# EAGLE design wtemp-receiver (EAGLE 5.11)
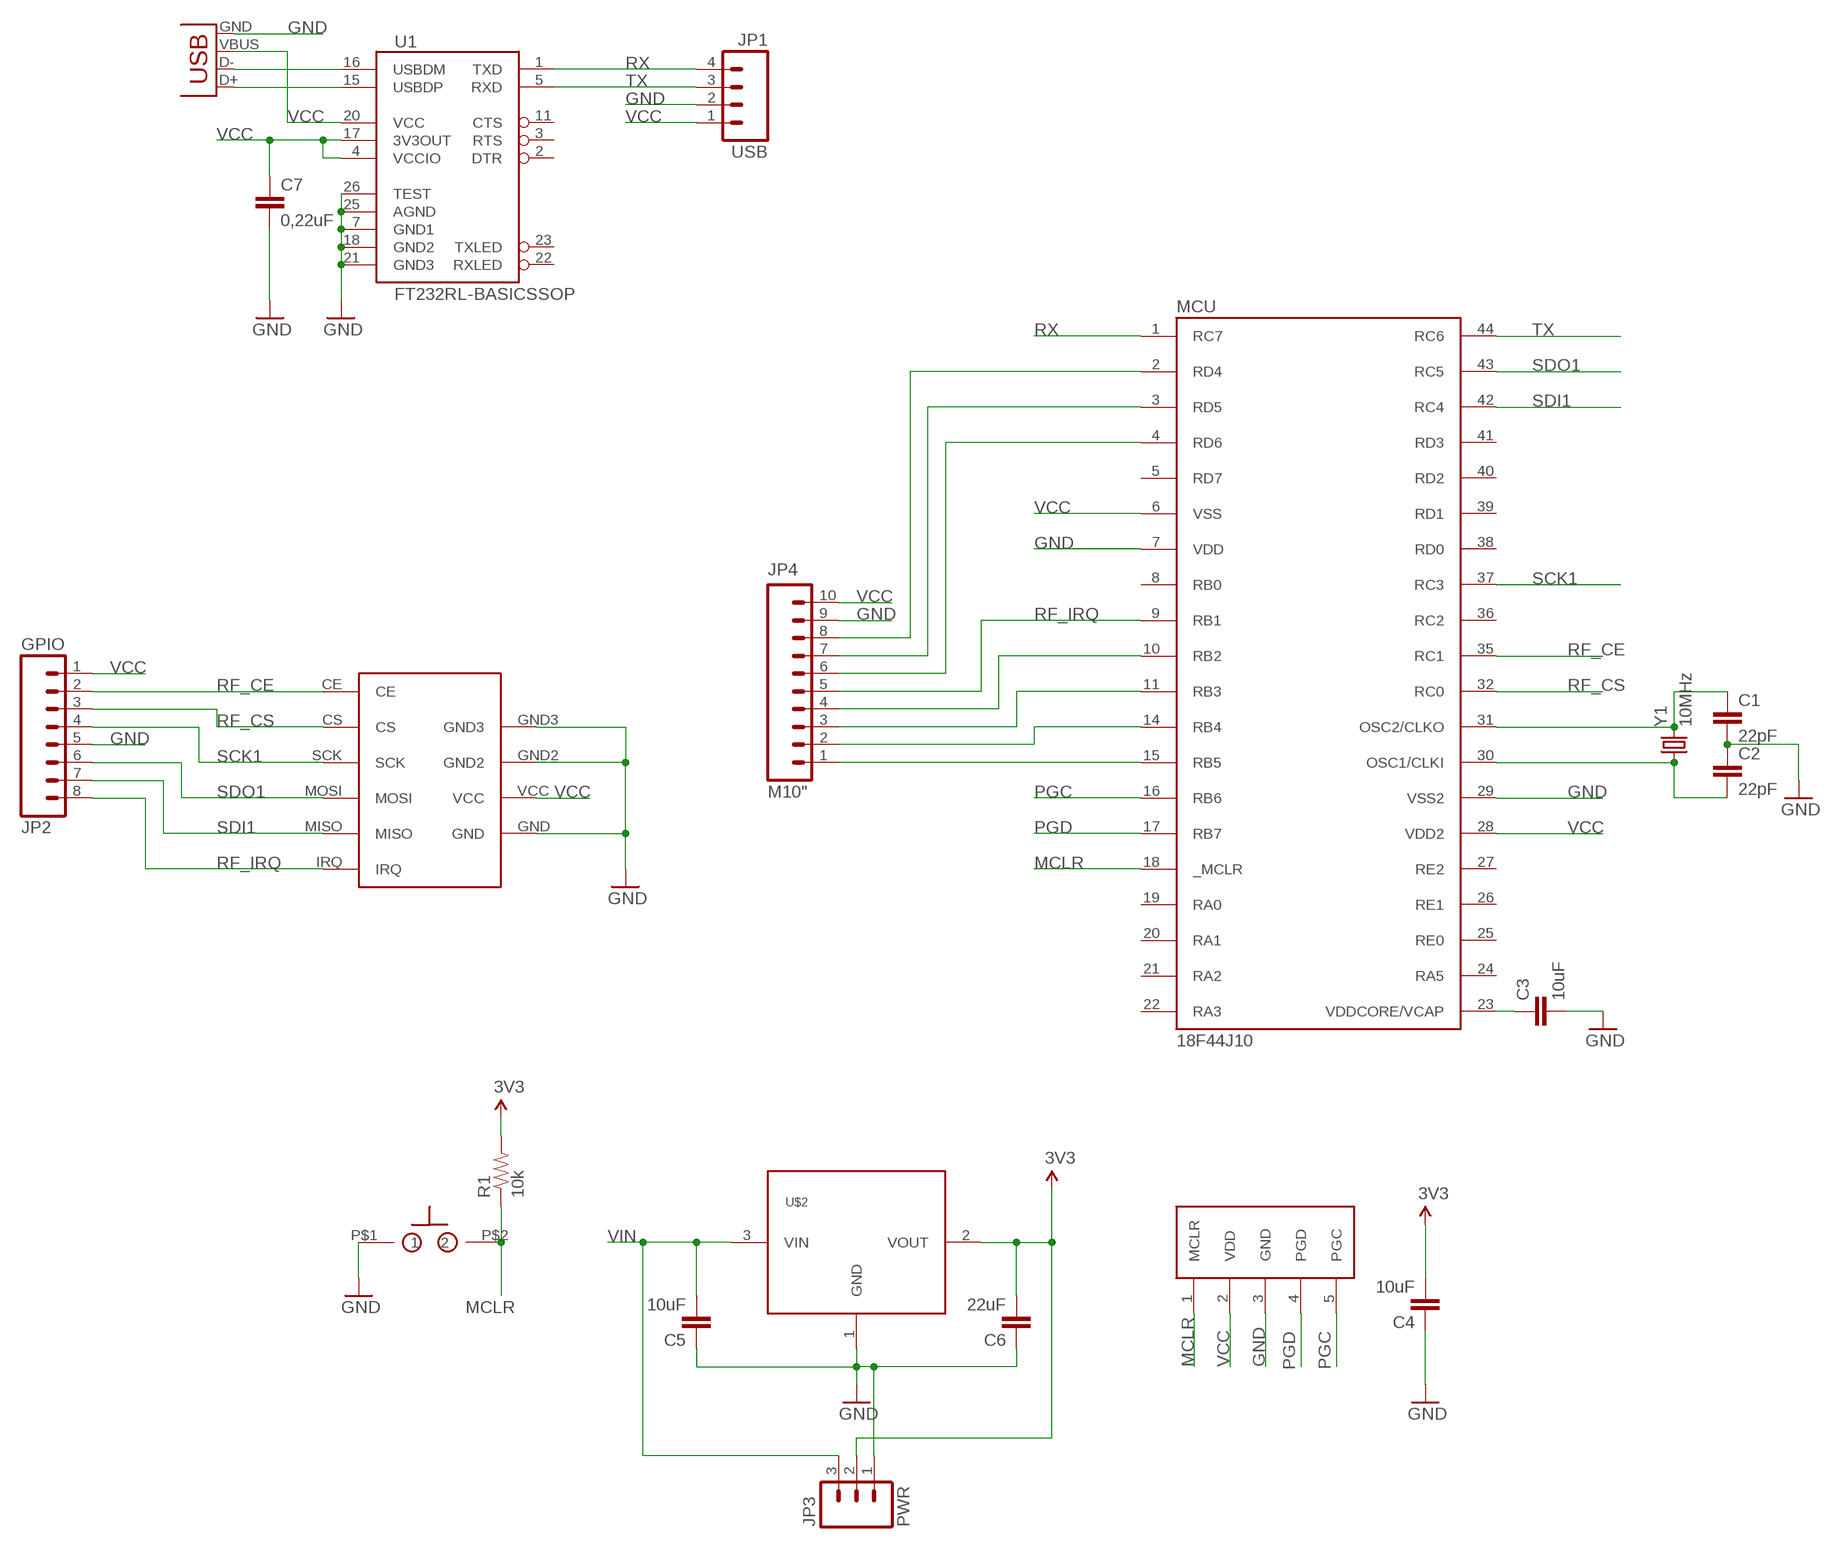
[diagram p0: schematic, sheet 1]

## Parts
C1  22pF  CAP0603-CAP  [0603-CAP]
C2  22pF  CAP0603-CAP  [0603-CAP]
C3  10uF  CAP0805  [0805]
C4  10uF  CAP0805  [0805]
C5  10uF  CAP0805  [0805]
C6  22uF  CAP0805  [0805]
C7  0,22uF  CAP0603-CAP  [0603-CAP]
JP1  USB  M041X04_NO_SILK  [1X04_NO_SILK]
JP2  GPIO  M081X08  [1X08]
JP3  PWR  M031X03_NO_SILK  [1X03_NO_SILK]
JP4  M10"  [1X10]
MCU  18F44J10  [TQFP44]
R1  10k  RESISTOR0603-RES  [0603-RES]
U1  FT232RL-BASICSSOP  [SSOP28DB]
U$1  PIC-ICSP  [1X05]
U$2  FAN1083S33X  [SOT223]
U$3  TACTILE-SWITCH  [6X3.5]
U$4  RF-2400-V03  [RF-2400-V03]
X1  USBSMD  [USB-MINIB]
Y1  10MHz  CRYSTAL  [ABMM2]

## Nets
GND: C1.2 C2.1 C3.2 C4.1 C5.1 C6.1 C7.2 JP1.2 JP2.5 JP3.1 JP4.9 MCU.7(VDD) MCU.29(VSS2) U1.7(GND1) U1.18(GND2) U1.21(GND3) U1.25(AGND) U1.26(TEST) U$1.3(GND) U$2.1(GND) U$3.P$1 U$4.GND U$4.GND2 U$4.GND3 X1.GND
MCLR: MCU.18(_MCLR) R1.1 U$1.1(MCLR) U$3.P$2
N$1: C1.1 MCU.31(OSC2/CLKO) Y1.P$3
N$2: C2.2 MCU.30(OSC1/CLKI) Y1.P$1
N$4: C3.1 MCU.23(VDDCORE/VCAP)
N$5: U1.15(USBDP) X1.D+
N$6: U1.16(USBDM) X1.D-
N$9: JP4.1 MCU.15(RB5)
N$10: JP4.2 MCU.14(RB4)
N$11: JP4.3 MCU.11(RB3)
N$12: JP4.4 MCU.10(RB2)
N$13: JP4.8 MCU.2(RD4)
N$14: JP4.7 MCU.3(RD5)
N$15: JP4.6 MCU.4(RD6)
PGC: MCU.16(RB6) U$1.5(PGC)
PGD: MCU.17(RB7) U$1.4(PGD)
RF_CE: JP2.2 MCU.35(RC1) U$4.CE
RF_CS: JP2.3 MCU.32(RC0) U$4.CS
RF_IRQ: JP2.8 JP4.5 MCU.9(RB1) U$4.IRQ
RX: JP1.4 MCU.1(RC7) U1.1(TXD)
SCK1: JP2.4 MCU.37(RC3) U$4.SCK
SDI1: JP2.7 MCU.42(RC4) U$4.MISO
SDO1: JP2.6 MCU.43(RC5) U$4.MOSI
TX: JP1.3 MCU.44(RC6) U1.5(RXD)
VCC: C4.2 C6.2 C7.1 JP1.1 JP2.1 JP3.2 JP4.10 MCU.6(VSS) MCU.28(VDD2) R1.2 U1.4(VCCIO) U1.17(3V3OUT) U1.20(VCC) U$1.2(VDD) U$2.2(VOUT) U$4.VCC X1.VBUS ; supply symbol labelled 3V3
VIN: C5.2 JP3.3 U$2.3(VIN)
Unconnected: MCU.5(RD7) MCU.8(RB0) MCU.19(RA0) MCU.20(RA1) MCU.21(RA2) MCU.22(RA3) MCU.24(RA5) MCU.25(RE0) MCU.26(RE1) MCU.27(RE2) MCU.36(RC2) MCU.38(RD0) MCU.39(RD1) MCU.40(RD2) MCU.41(RD3) U1.2(DTR) U1.3(RTS) U1.11(CTS) U1.22(RXLED) U1.23(TXLED)

## Library data of the parts
C1-C7 = SparkFun:CAP: Capacitor Standard 0603 ceramic capacitor, and 0.1" leaded capacitor.
JP1 = SparkFun:M04: Header 4 Standard 4-pin 0.1" header. Use with straight break away headers (SKU : PRT-00116), right angle break away headers (PRT-00553), swiss pins (PRT-00743), machine pins (PRT-00117), and female headers (PRT-00115). Molex polarized connector foot print use with SKU : PRT-08231 with associated crimp pins and housings. 1MM SMD Version SKU: PRT-10208
JP2 = SparkFun:M08: Header 8 Standard 8-pin 0.1" header. Use with straight break away headers (SKU : PRT-00116), right angle break away headers (PRT-00553), swiss pins (PRT-00743), machine pins (PRT-00117), and female headers (PRT-00115).
JP3 = SparkFun:M03: Header 3 Standard 3-pin 0.1" header. Use with straight break away headers (SKU : PRT-00116), right angle break away headers (PRT-00553), swiss pins (PRT-00743), machine pins (PRT-00117), and female headers (PRT-00115). Molex polarized connector foot print use with SKU : PRT-08232 with associated crimp pins and housings.
JP4 = SparkFun:M10: Header 10 Standard 10-pin 0.1" header. Use with straight break away headers (SKU : PRT-00116), right angle break away headers (PRT-00553), swiss pins (PRT-00743), machine pins (PRT-00117), and female headers (PRT-00115).
MCU = sak:18F44J10
R1 = SparkFun:RESISTOR: Resistor Basic schematic elements and footprints for 0603, 1206, and PTH resistors.
U1 = SparkFun:FT232RL-BASIC: USB UART This is the simplified version of the FT232RL unit. Only what you need, nothing you don't. Spark Fun Electronics SKU : COM-00650
U$1 = sak:PIC-ICSP
U$2 = sak:FAN1083S33X
U$3 = sak:TACTILE-SWITCH
U$4 = sak:RF-2400-V03
X1 = SparkFun:USB: USB Connectors USB-B-PTH is fully proven SKU : PRT-00139 USB-miniB is fully proven SKU : PRT-00587 USB-A-PCB is untested. USB-A-H is throughly reviewed, but untested. Spark Fun Electronics SKU : PRT-00437 USB-B-SMT is throughly reviewed, but untested. Needs silkscreen touching up. USB-A-S has not been used/tested USB-MB-H has not been used/tested
Y1 = sak:CRYSTAL: Crystals Various standard crystals. Proven footprints. Spark Fun Electronics SKU : COM-00534

## Board
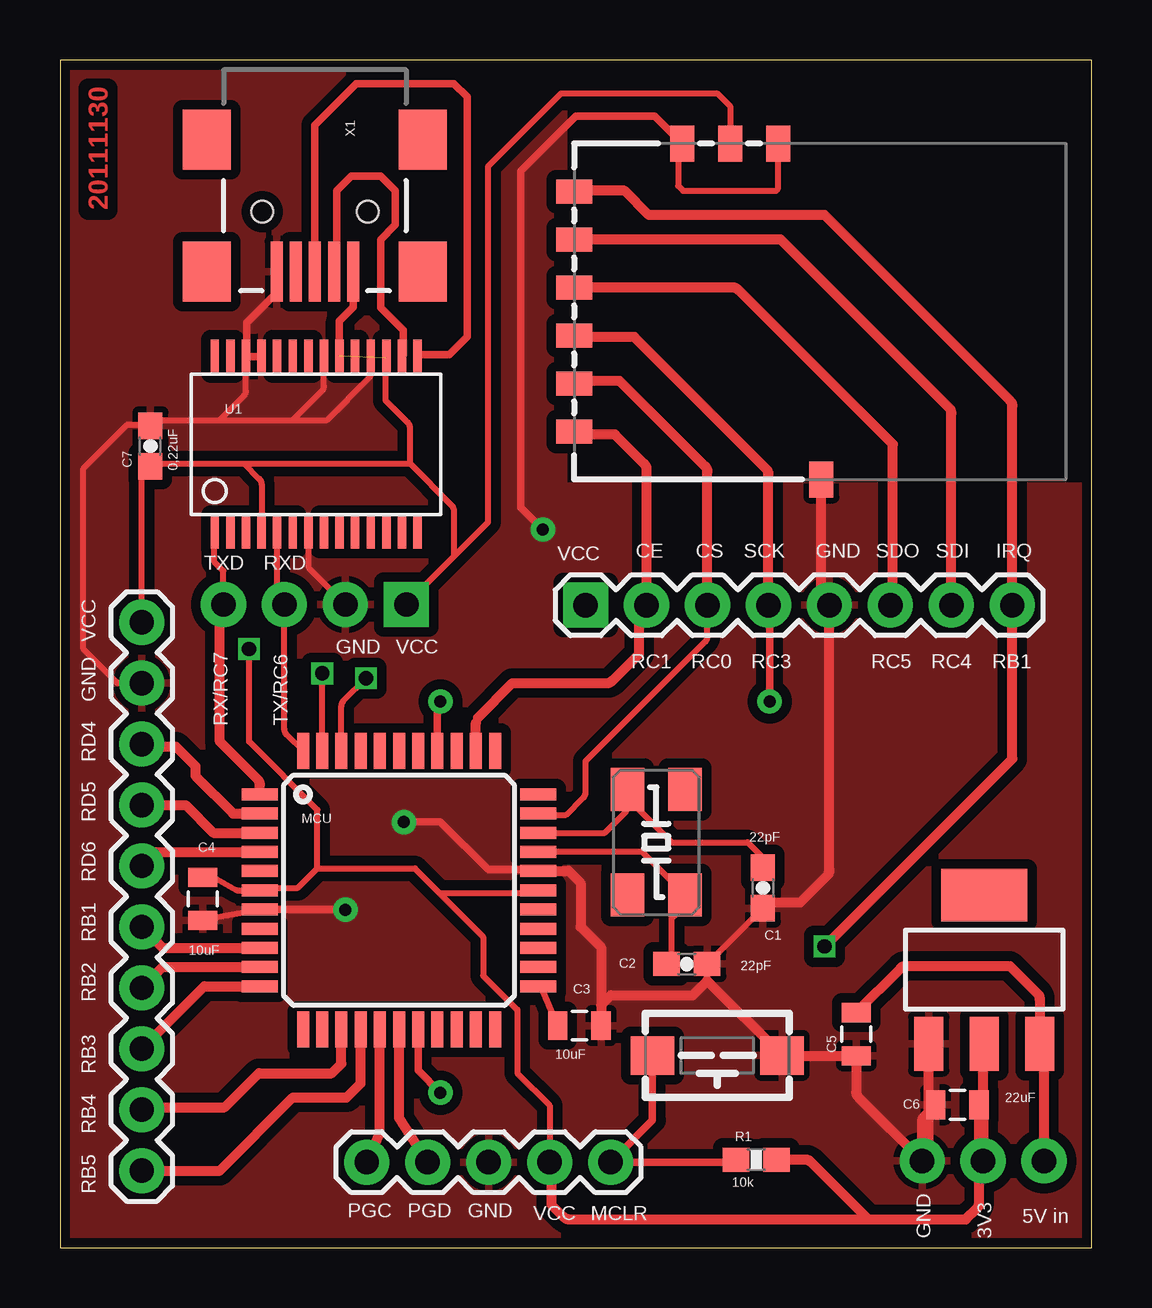
[diagram p1: board, top side]
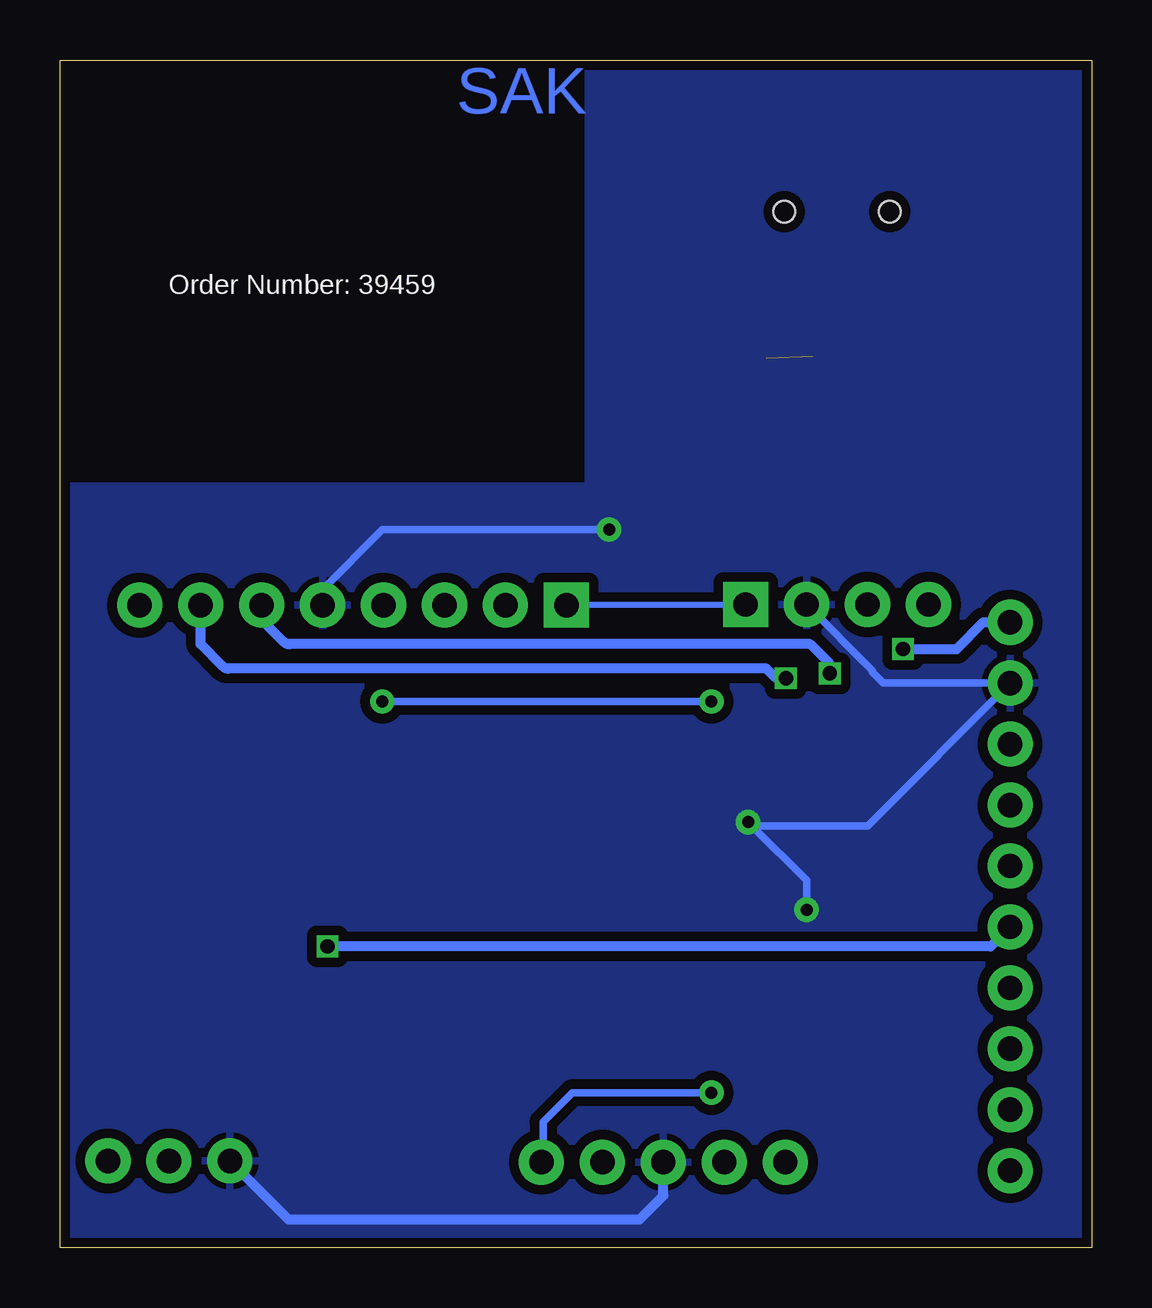
[diagram p2: board, bottom side, seen from below]

Size 43 x 49.5 mm. Coordinates in mm from the lower left corner, seen from the top.
Outline: 0,0 43,0 43,49.5 0,49.5 0,0
Copper layers (1*16): Top 0.035mm / dielectric 1.5mm / Bottom 0.035mm
Design rules "Fusion_eagle_rule_v1.1": minimum track width 6mil, minimum drill 12mil, track to track 6mil, track to pad 6mil, pad to pad 6mil, via to via 6mil, smd to smd 0mil, copper to edge 10mil, drill to drill 10mil, minimum pad ring 10mil, minimum via ring 6mil, stop-mask expansion 2mil, vias tented up to drill 100mil, thermal gap 10mil

### Footprints (pad centres in the part's own frame; a part is rotated, then mirrored left to right if it is on the bottom)
0603-CAP = smd 1.1 x 1: 1 -0.85,0; 2 0.85,0
0805 = smd 0.8 x 1.2: 1 -0.9,0; 2 0.9,0
1X04_NO_SILK = drill 1.016 pad 1.88 square: 1 0,0 | drill 1.016 pad 1.88 round: 2 2.54,0; 3 5.08,0; 4 7.62,0
1X08 = drill 1.016 pad 1.88 square: 1 0,0 | drill 1.016 pad 1.88 round: 2 2.54,0; 3 5.08,0; 4 7.62,0; 5 10.16,0; 6 12.7,0; 7 15.24,0; 8 17.78,0
1X03_NO_SILK = drill 1.016 pad 1.88 round: 1 0,0; 2 2.54,0; 3 5.08,0
1X10 = drill 1.016 pad 1.88 round: 1 0,0; 2 2.54,0; 3 5.08,0; 4 7.62,0; 5 10.16,0; 6 12.7,0; 7 15.24,0; 8 17.78,0; 9 20.32,0; 10 22.86,0
TQFP44 = smd 1.5 x 0.5: 1 -5.8,4; 2 -5.8,3.2; 3 -5.8,2.4; 4 -5.8,1.6; 5 -5.8,0.8; 6 -5.8,0; 7 -5.8,-0.8; 8 -5.8,-1.6; 9 -5.8,-2.4; 10 -5.8,-3.2; 11 -5.8,-4; 23 5.8,-4; 24 5.8,-3.2; 25 5.8,-2.4; 26 5.8,-1.6; 27 5.8,-0.8; 28 5.8,0; 29 5.8,0.8; 30 5.8,1.6; 31 5.8,2.4; 32 5.8,3.2; 33 5.8,4 | smd 0.5 x 1.5: 12 -4,-5.8; 13 -3.2,-5.8; 14 -2.4,-5.8; 15 -1.6,-5.8; 16 -0.8,-5.8; 17 0,-5.8; 18 0.8,-5.8; 19 1.6,-5.8; 20 2.4,-5.8; 21 3.2,-5.8; 22 4,-5.8; 34 4,5.8; 35 3.2,5.8; 36 2.4,5.8; 37 1.6,5.8; 38 0.8,5.8; 39 0,5.8; 40 -0.8,5.8; 41 -1.6,5.8; 42 -2.4,5.8; 43 -3.2,5.8; 44 -4,5.8
0603-RES = smd 1.1 x 1: 1 -0.85,0; 2 0.85,0
SSOP28DB = smd 0.348 x 1.397: 1 -4.225,-3.656; 2 -3.575,-3.656; 3 -2.925,-3.656; 4 -2.275,-3.656; 5 -1.625,-3.656; 6 -0.975,-3.656; 7 -0.325,-3.656; 8 0.325,-3.656; 9 0.975,-3.656; 10 1.625,-3.656; 11 2.275,-3.656; 12 2.925,-3.656; 13 3.575,-3.656; 14 4.225,-3.656; 15 4.225,3.656; 16 3.575,3.656; 17 2.925,3.656; 18 2.275,3.656; 19 1.625,3.656; 20 0.975,3.656; 21 0.325,3.656; 22 -0.325,3.656; 23 -0.975,3.656; 24 -1.625,3.656; 25 -2.275,3.656; 26 -2.925,3.656; 27 -3.575,3.656; 28 -4.225,3.656
1X05 = drill 1.016 pad 1.88 round: 1 0,0; 2 2.54,0; 3 5.08,0; 4 7.62,0; 5 10.16,0
SOT223 = smd 1.219 x 2.235: 1 -2.311,-3.099; 2 0,-3.099; 3 2.311,-3.099 | smd 3.6 x 2.2: 4 0,3.099
6X3.5 = smd 1.8 x 1.6: P$1 -2.7,0; P$2 2.7,0
RF-2400-V03 = smd 1.5 x 1: CE 10,5; CS 10,3; IRQ 10,-5; MISO 10,-3; MOSI 10,-1; SCK 10,1 | smd 1 x 1.5: GND 5.507,-7; GND2 1.507,-7; GND3 -0.3,7; VCC 3.507,-7
USB-MINIB = smd 2.5 x 0.5: D+ 2.5,0; D- 2.5,0.8; GND 2.5,-1.6; ID 2.5,-0.8; VBUS 2.5,1.6 | smd 2.5 x 2: MTN1 -3,4.5; MTN2 2.5,4.5; MTN3 -3,-4.5; MTN4 2.5,-4.5 | hole 0.9: 0,2.2; 0,-2.2
ABMM2 = smd 1.8 x 1.4: P$1 -2.2,-1.2; P$2 2.2,-1.2; P$3 2.2,1.2; P$4 -2.2,1.2

### Placement (x,y rotation side)
C1  29.29,14.99 270 top
C2  26.12,11.81 180 top
C3  21.64,9.25 0 top
C4  5.95,14.53 90 top
C5  33.18,8.89 90 top
C6  37.39,5.95 0 top
C7  3.76,33.41 90 top
JP1  14.43,26.8 180 top
JP2  21.9,26.78 0 top
JP3  35.92,3.61 0 top
JP4  3.41,3.2 90 top
MCU  14.13,14.89 0 top
R1  29.01,3.66 0 top
U1  10.67,33.48 0 top
U$1  22.94,3.56 180 top
U$2  38.51,11.59 0 top
U$3  27.39,8.01 180 top
U$4  31.42,39.02 180 top
X1  10.62,43.18 270 top
Y1  24.85,16.89 90 top

### Tracks (layer width: path | path; a pad name or v marks a point on that pad's centre or on a via)
GND  (via drill 0.5 pad 1.02)
  Top 0.254: 9.02,39.81 X1.GND | 7.83,37.22 U1.26 7.75,35.72 arc-45 7.65,35.49 6.66,34.5 | JP1.2 10.37,28.32 10.37,29.8 U1.7 | 6.66,34.5 4.14,34.5 arc45 3.91,34.4 C7.2 3.72,34.29 2.8,34.29 0.97,32.47 0.97,24.95 2.39,23.52 JP4.9 | U1.18 12.95,36.45 arc-45 12.85,36.22 11.13,34.5 9.71,34.5 | 6.66,34.5 9.71,34.5 | U1.21 11,35.92 arc-45 10.9,35.69 9.71,34.5 | 31.82,27.02 arc-45 31.72,27.24 | 29.66,14.38 arc45 29.44,14.29 C1.2 C2.1 26.97,11.12 | MCU.7 6,13.68 C4.1 | MCU.29 20.02,15.6 | U$4.GND2 29.92,44.14 29.82,44.05 25.96,44.05 25.76,44.25 25.76,45.86 U$4.GND
  Top 0.305: U1.25 U1.26 7.78,37.17 7.78,38.56 9.02,39.81 | v20.12,29.93 19.21,30.84 19.21,44.86 21.49,47.15 24.79,47.15 U$4.GND | MCU.7 11.88,14.09 v11.89,14.08 | v14.33,17.73 15.85,17.73 17.84,15.75 19.86,15.75 MCU.29
  Top 0.406: 26.97,11.12 U$3.P$1 arc45 30.11,7.99 C5.1 33.18,6.49 arc45 33.27,6.26 JP3.1 | 31.72,27.24 U$4.GND3 | 31.82,27.02 JP2.5 32.06,15.73 arc-45 31.97,15.51 30.84,14.38 29.66,14.38 | U$2.1 36.2,4.02 arc-45 36.11,3.8 JP3.1 | JP3.1 35.92,5.24 arc-45 36.01,5.47 C6.1 | 22.55,10.11 22.55,12.52 21.7,13.36 21.7,15.19 21.19,15.7 19.94,15.7 MCU.29 | 22.55,10.11 C3.2 | 26.97,11.12 26.37,10.52 22.95,10.52 22.55,10.11
  Bottom 0.305: JP2.5 32.06,27.44 29.57,29.93 v20.12,29.93 | v11.89,14.08 11.89,15.29 14.18,17.58 | 14.18,17.58 v14.33,17.73 | 14.18,17.58 9.35,17.58 JP4.9 8.69,23.52 9.15,23.98 9.15,24.06 JP1.2
  Bottom 0.406: U$1.3 17.86,2.16 18.85,1.17 33.48,1.17 JP3.1
  pour Bottom (isolate 0.406): -0.01,49.25 20.99,49.25 20.99,31.75 42.99,31.75 42.99,0.25 -0.01,0.25
  pour Top (isolate 0.406): 0.49,49.25 20.99,49.25 20.99,31.75 42.99,31.75 42.99,0.25 -0.01,0.25 -0.01,49.25
MCLR  (via drill 0.5 pad 1.02)
  Top 0.305: MCU.18 14.93,7.38 v15.85,6.46 | U$3.P$2 24.69,5.3 U$1.1 28.06,3.56 R1.1
  Bottom 0.305: v15.85,6.46 21.65,6.46 22.86,5.24 22.86,3.64 U$1.1
N$1
  Top 0.254: MCU.31 22.7,17.29 23.58,18.16 23.58,19.02 Y1.P$3 23.65,18.73 25.48,16.89 28.66,16.89 29.29,16.26 C1.1
N$2
  Top 0.254: MCU.30 24.25,16.49 Y1.P$1 26.05,14.29 25.48,13.72 25.48,12.03 C2.2
N$4
  Top 0.254: C3.1 20.14,10.68 MCU.23
N$5
  Top 0.254: U1.15 14.98,37.22
  Top 0.305: 14.98,37.22 16.21,37.22 16.97,37.98 16.97,47.96 16.41,48.52 12.35,48.52 10.62,46.79 X1.D+
N$6
  Top 0.254: U1.16 14.3,37.19
  Top 0.305: 14.3,37.19 14.3,38.23 13.36,39.17 13.36,42.02 13.97,42.62 13.97,44.05 13.36,44.66 12.15,44.66 11.54,44.05 11.54,40.8 X1.D-
N$9
  Top 0.406: MCU.15 12.53,6.84 11.94,6.25 9.71,6.25 6.66,3.2 JP4.1
N$10
  Top 0.406: MCU.14 11.73,7.66 11.33,7.27 8.28,7.27 6.86,5.85 3.51,5.85 JP4.2
N$11
  Top 0.406: MCU.11 6.01,10.89 JP4.3
N$12
  Top 0.406: MCU.10 4.27,11.69 JP4.4
N$13
  Top 0.406: MCU.2 7.22,18.09 5.64,19.66 5.64,20.07 4.83,20.88 3.51,20.88 JP4.8
N$14
  Top 0.406: MCU.3 6.39,17.29 5.24,18.44 JP4.7
N$15
  Top 0.406: MCU.4 3.99,16.49 JP4.6
PGC
  Top 0.406: U$1.5 13.33,4.74 MCU.16
PGD
  Top 0.406: U$1.4 14.13,5.39 MCU.17
RF_CE
  Top 0.254: 21.69,33.89 arc-45 21.46,33.98 U$4.CE | 24.13,26.34 arc-45 24.23,26.56 | 17.33,21.87 arc-45 17.42,22.09
  Top 0.406: 21.69,33.89 23.12,33.89 24.35,32.66 arc-45 24.44,32.44 JP2.2 24.23,26.56 | 24.13,26.34 24.13,24.74 23.01,23.62 arc-45 22.78,23.52 18.85,23.52 17.42,22.09 | MCU.35 17.33,21.87
RF_CS
  Top 0.254: 21.66,36.12 arc45 U$4.CS | MCU.32 arc45 20.05,18.04 21.09,18.04 21.81,18.76 arc45 21.9,18.98 21.9,20.27 26.89,25.26 arc45 26.98,25.48 JP2.3
  Top 0.406: JP2.3 26.98,32.33 arc45 26.89,32.56 23.32,36.12 21.66,36.12
RF_IRQ  (via drill 0.6)
  Top 0.254: 21.49,44.05 arc45 U$4.IRQ
  Top 0.406: MCU.9 4.28,12.49 JP4.5 | v31.86,12.55 39.68,20.38 JP2.8 39.68,35.08 arc45 39.59,35.3 31.86,43.03 24.54,43.03 23.52,44.05 21.49,44.05
  Bottom 0.406: v31.86,12.55 4.22,12.55 JP4.5
RX
  Top 0.254: U1.1 6.43,29.81 6.43,28.58 6.81,28.2 JP1.4 6.75,26.74 arc45 6.66,26.52
  Top 0.406: MCU.1 8.33,19.29 arc45 8.23,19.51 6.66,21.09 6.66,26.52
SCK1  (via drill 0.5 pad 1.02)
  Top 0.254: 21.59,37.95 arc-45 U$4.SCK
  Top 0.305: MCU.37 15.73,22.64 v15.85,22.76 | v29.57,22.76 29.57,26.73 JP2.4
  Top 0.406: JP2.4 29.52,32.23 arc45 29.43,32.46 23.93,37.95 21.59,37.95
  Bottom 0.305: v15.85,22.76 v29.57,22.76
SDI1  (via drill 0.6)
  Top 0.254: U$4.MISO arc-45 U$4.MISO | MCU.42 11.73,22.57 arc-45 11.82,22.79 v12.76,23.73
  Top 0.406: JP2.7 37.14,34.77 arc45 37.05,35 30.03,42.02 U$4.MISO
  Bottom 0.406: v12.76,23.73 13.03,23.73 arc45 13.25,23.82 13.57,24.13 35.99,24.13 arc45 36.22,24.23 37.14,25.15 JP2.7
SDO1  (via drill 0.6)
  Top 0.254: 34.61,26.78 arc45 34.7,27.01 | MCU.43 v10.93,23.93
  Top 0.406: U$4.MOSI 28.03,40.02 arc-45 28.26,39.92 34.7,33.48 34.7,27.01 | JP2.6 34.61,26.78
  Bottom 0.254: 34.59,26.75 arc-45 JP2.6
  Bottom 0.406: 34.59,26.75 34.59,26.17 33.67,25.24 arc-45 33.44,25.15 11.74,25.15 10.93,24.34 v10.93,23.93
TX
  Top 0.254: U1.5 9.05,27.11 JP1.3 9.35,21.59 arc45 9.44,21.37 MCU.44
VCC  (via drill 0.6)  (1 unrouted)
  Top 0.254: 16.41,28.81 16.31,28.71 14.45,26.84 arc45 JP1.1 arc45 14.49,26.78 | 16.41,28.81 16.41,30.71 arc45 16.32,30.93 14.58,32.67 | 7.68,32.67 4.01,32.67 arc45 3.78,32.58 C7.1 3.41,32.2 JP4.10 | 7.68,32.67 14.58,32.67 | U1.4 8.4,31.81 arc45 8.3,32.04 7.68,32.67 | 14.58,32.67 14.58,34.16 arc45 14.49,34.39 13.57,35.31 13.57,37.07 arc-45 U1.17 | C4.2 6.11,15.4 6.46,15.4 7.37,14.89 MCU.6 8.43,14.99 9.91,14.99 10.72,15.8 | v7.88,24.95 7.88,21.09 10.72,18.24 10.72,15.8 | 10.72,15.8 14.79,15.8 15.8,14.79 | 15.8,14.79 19.83,14.79 MCU.28 | U$4.VCC 27.92,47.58 27.39,48.11 20.88,48.11 17.84,45.06 17.84,30.23 16.41,28.81 | 15.8,14.79 17.63,12.96 17.63,11.33 19.05,9.91 19.05,7.27 20.4,5.92 U$1.2 | U1.20
  Top 0.305: X1.VBUS 12.22,39.2 11.64,38.61 U1.20
  Top 0.406: U$2.2 arc45 38.46,8.37 JP3.2 38.46,5.65 arc45 38.37,5.87 C6.2 38.29,1.85 arc-45 38.2,1.62 37.75,1.17 33.68,1.17 | 33.68,1.17 21.22,1.17 arc-45 20.99,1.26 20.48,1.78 20.48,3.38 arc45 U$1.2 | R1.2 31.06,3.66 arc-45 31.29,3.57 33.68,1.17
  Bottom 0.254: JP2.1 14.46,26.78 JP1.1
  Bottom 0.406: JP4.10 4.53,26.06 5.64,24.95 v7.88,24.95
VIN
  Top 0.406: JP3.3 41,8.18 arc45 40.91,8.4 U$2.3 40.82,10.36 arc45 40.73,10.59 39.58,11.74 35.25,11.74 arc45 35.03,11.65 C5.2

### Text on the board
Top: 20111130
Bottom: SAK
tPlace: VCC | CE | CS | SCK | GND | SDO | SDI | IRQ | TXD | RXD | VCC | GND | VCC | RC1 | RC0 | RC3 | RC5 | RC4 | RB1 | GND | RX/RC7 | TX/RC6 | RD4 | RD5 | RD6 | RB1 | RB2 | RB3 | RB4 | RB5 | PGC | PGD | GND | VCC | MCLR | GND | 3V3 | 5V in
bPlace: Order Number: 39459